# EAGLE design Lora TDS sensor V1.2 (EAGLE 6.1)
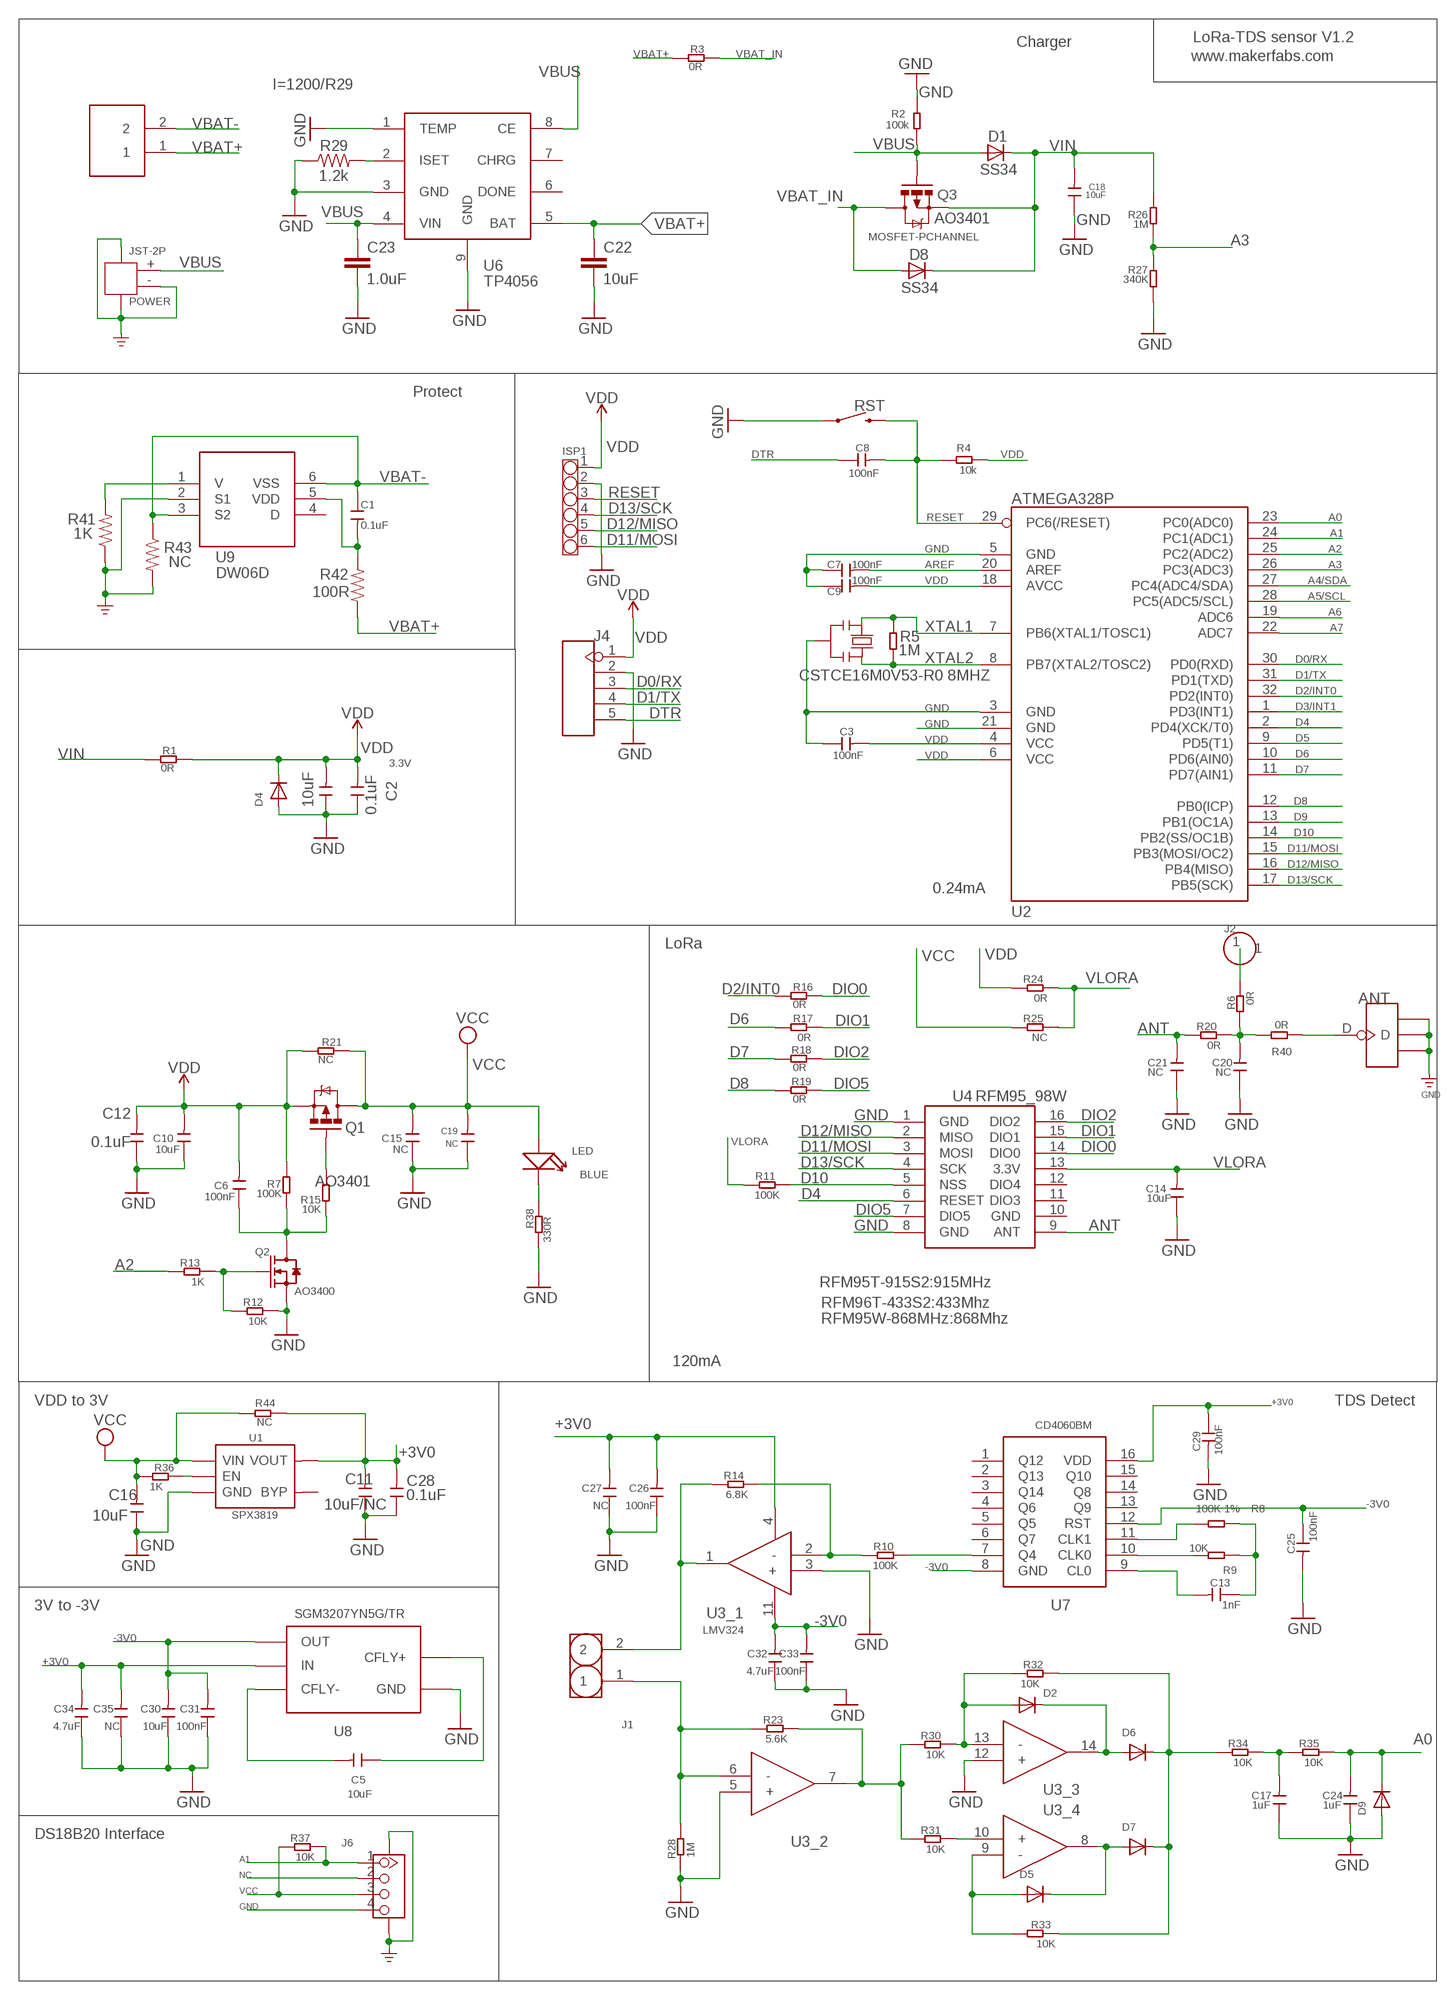
[diagram p0: schematic, sheet 1]

## Parts
ANT  ANTENNA-U-FL  [4P-U-FL]
C1  0.1uF  C-0603  [0603]
C2  0.1uF  C-0603  [0603]
C3  100nF  C-0603  [0603]
C4  10uF  C-0603  [0603]
C5  10uF  C-0603  [0603]
C6  100nF  C-0603  [0603]
C7  100nF  C-0603  [0603]
C8  100nF  C-0603  [0603]
C9  100nF  C-0603  [0603]
C10  10uF  C-0603  [0603]
C11  10uF/NC  C-0603  [0603]
C12  0.1uF  C-0603  [0603]
C13  1nF  C-0603  [0603]
C14  10uF  C-0603  [0603]
C15  NC  C-0603  [0603]
C16  10uF  C-0603  [0603]
C17  1uF  C-0603  [0603]
C18  10uF  C-0603  [0603]
C19  NC  C-0603  [0603]
C20  NC  C-0603  [0603]
C21  NC  C-0603  [0603]
C22  10uF  10UF-1206-6.3V-20%  [1206]
C23  1.0uF  1.0UF-0603-16V-10%  [0603]
C24  1uF  C-0603  [0603]
C25  100nF  C-0603  [0603]
C26  100nF  C-0603  [0603]
C27  NC  C-0603  [0603]
C28  0.1uF  C-0603  [0603]
C29  100nF  C-0603  [0603]
C30  10uF  C-0603  [0603]
C31  100nF  C-0603  [0603]
C32  4.7uF  C-0603  [0603]
C33  100nF  C-0603  [0603]
C34  4.7uF  C-0603  [0603]
C35  NC  C-0603  [0603]
D1  SS34  DIODE-DO-214AC  [DO-214AC]
D2  DIODESOD-323F  [SOD-323F]
D4  DIODESOD-323F  [SOD-323F]
D5  DIODESOD-323F  [SOD-323F]
D6  DIODESOD-323F  [SOD-323F]
D7  DIODESOD-323F  [SOD-323F]
D8  SS34  DIODE-DO-214AC  [DO-214AC]
D9  DIODESOD-323F  [SOD-323F]
ISP1  CONNECTOR-HEADER-6P-3460270P1  [1X6P-2.54-8.5-BLACK-FEMALE]
J1  HEADER-2P-65/35MIL  [2P-2.54-65/35MIL]
J2  HEADER-1P-50  [1P-100/50MIL]
J4  HEADER-5P-2.54  [5P-2.54]
J5  PH2.0-2P-90-DIP  [PH2.0-2P-90-DIP]
J6  GROVE-CONNECTOR-SMD'90D'  [HW4-SMD-2.0-90D]
LED  BLUE  LED'0603'  [LED-0603]
POWER  JST-2P  JST-2P-SMD'2.0'  [HW2-SMD-2.0-90D]
Q1  MOSFET-PCHANNEL  [SOT23-3]
Q2  AO3400  DISCRETE_MOSFET-NSOT23  [DISCRETE_SOT23]
Q3  MOSFET-PCHANNEL  [SOT23-3]
R1  0R  R-0603  [R0603]
R2  100k  R-0603  [R0603]
R3  0R  R-0603  [R0603]
R4  10k  R-0603  [R0603]
R5  1M  R-0603  [R0603]
R6  0R  R-0603  [R0603]
R7  100K  R-0603  [R0603]
R8  100K 1%  R-0603  [R0603]
R9  10K  R-0603  [R0603]
R10  100K  R-0603  [R0603]
R11  100K  R-0603  [R0603]
R12  10K  R-0603  [R0603]
R13  1K  R-0603  [R0603]
R14  6.8K  R-0603  [R0603]
R15  10K  R-0603  [R0603]
R16  0R  R-0603  [R0603]
R17  0R  R-0603  [R0603]
R18  0R  R-0603  [R0603]
R19  0R  R-0603  [R0603]
R20  0R  R-0603  [R0603]
R21  NC  R-0603  [R0603]
R23  5.6K  R-0603  [R0603]
R24  0R  R-0603  [R0603]
R25  NC  R-0603  [R0603]
R26  1M  R-0603  [R0603]
R27  340K  R-0603  [R0603]
R28  1M  R-0603  [R0603]
R29  1.2k  2.49KOHM-0603-1/10W-1%  [0603]
R30  10K  R-0603  [R0603]
R31  10K  R-0603  [R0603]
R32  10K  R-0603  [R0603]
R33  10K  R-0603  [R0603]
R34  10K  R-0603  [R0603]
R35  10K  R-0603  [R0603]
R36  1K  R-0603  [R0603]
R37  10K  R-0603  [R0603]
R38  330R  R-0603  [R0603]
R40  0R  R-0603  [R0603]
R41  1K  10KOHM-0603-1/10W-1%  [0603]
R42  100R  10KOHM-0603-1/10W-1%  [0603]
R43  NC  10KOHM-0603-1/10W-1%  [0603]
R44  NC  R-0603  [R0603]
RST  MOMENTARY-SWITCH-SPST-SMD-6.0X3.5MM  [TACTILE_SWITCH_SMD_6.0X3.5MM]
U1  SPX3819  [SOT23-5]
U2  ATMEGA328P  ATMEGA8/168/328  [TQFP32]
U3  LM324_1  [SOP-14]
U4  RFM95_98W  RFM92_93W  [RFM92_93W]
U6  TP4056  [SOP8-1.27P]
U7  CD4060  [SOIC-16]
U8  TPS60400DBVR  [SOT23-5]
U9  DW06D  [SOT-23-6]
Y1  CSTCE16M0V53-R0 8MHZ  RESONATORMU  [RESONATOR]

## Nets
+3V0: C11.2 C26.2 C27.2 C28.2 C29.1 C34.2 C35.2 R44.2 U1.5(VOUT) U3.4(_1:VDD) U7.16(VDD) U8.P$2(IN)
-3V0: C25.1 C30.2 C31.2 C32.2 C33.2 U3.11(_1:VSS) U7.8(GND) U7.12(RST) U8.P$1(OUT)
A0: C24.2 D9.C R35.1 U2.23(PC0(ADC0))
A1: J6.1 R37.1 U2.24(PC1(ADC1))
A2: R13.2 U2.25(PC2(ADC2))
A3: R26.1 R27.2 U2.26(PC3(ADC3))
A4/SDA: U2.27(PC4(ADC4/SDA))
A5/SCL: U2.28(PC5(ADC5/SCL))
A6: U2.19(ADC6)
A7: U2.22(ADC7)
ANT: C21.2 R20.2 U4.9(ANT)
AREF: C7.2 U2.20(AREF)
D0/RX: J4.3 U2.30(PD0(RXD))
D1/TX: J4.4 U2.31(PD1(TXD))
D2/INT0: R16.1 U2.32(PD2(INT0))
D3/INT1: U2.1(PD3(INT1))
D4: U2.2(PD4(XCK/T0)) U4.6(RESET)
D5: U2.9(PD5(T1))
D6: R17.1 U2.10(PD6(AIN0))
D7: R18.1 U2.11(PD7(AIN1))
D8: R19.1 U2.12(PB0(ICP))
D9: U2.13(PB1(OC1A))
D10: R11.1 U2.14(PB2(SS/OC1B)) U4.5(NSS)
D11/MOSI: ISP1.6 U2.15(PB3(MOSI/OC2)) U4.3(MOSI)
D12/MISO: ISP1.5 U2.16(PB4(MISO)) U4.2(MISO)
D13/SCK: ISP1.4 U2.17(PB5(SCK)) U4.4(SCK)
DIO0: R16.2 U4.14(DIO0)
DIO1: R17.2 U4.15(DIO1)
DIO2: R18.2 U4.16(DIO2)
DIO5: R19.2 U4.7(DIO5)
DTR: C8.1 J4.5
GND: ANT.GND1 ANT.GND2 ANT.GND3 C2.1 C3.1 C4.1 C7.1 C9.1 C10.1 C11.1 C12.1 C14.1 C15.1 C16.1 C17.1 C18.1 C19.1 C20.1 C21.1 C22.2 C23.2 C24.1 C25.2 C26.1 C27.1 C28.1 C29.2 C30.1 C31.1 C32.1 C33.1 C34.1 C35.1 D4.A D9.A ISP1.2 J4.2 J6.4 J6.SS1 J6.SS2 POWER.3 POWER.4 POWER.- Q2.2(S) R2.2 R12.1 R27.1 R28.2 R29.1 R38.2 R41.1 R43.2 RST.1 U1.2(GND) U2.3(GND) U2.5(GND) U2.21(GND) U3.3(_1:+) U3.5(_2:+) U3.12(_4:+) U4.1(GND) U4.8(GND) U6.1(TEMP) U6.3(GND) U6.9(GND) U8.P$4(GND) U9.2(S1) Y1.2
ISET: R29.2 U6.2(ISET)
N$1: C1.2 R42.2 U9.5(VDD)
N$2: R36.2 U1.3(EN)
N$3: LED.- R38.1
N$4: R8.1 U7.11(CLK1)
N$5: R9.1 U7.10(CLK0)
N$6: J2.1 R6.1
N$7: Q1.1(G) R15.2
N$8: C6.1 Q2.3(D) R7.1 R15.1
N$9: C13.2 U7.9(CL0)
N$10: Q2.1(G) R12.2 R13.1
N$11: C13.1 R8.2 R9.2
N$12: C20.2 R6.2 R20.1 R40.1
N$13: R41.2 U9.1(V)
N$15: C5.2 U8.P$3(CFLY-)
N$16: R10.1 U7.7(Q4)
N$17: C5.1 U8.P$5(CFLY+)
N$18: R10.2 R14.1 U3.2(_1:-)
N$19: J1.2 R14.2 U3.1(_1:OUT)
N$20: J1.1 R23.2 R28.1 U3.6(_2:-)
N$21: R23.1 R30.2 R31.2 U3.7(_2:OUT)
N$22: D2.A R30.1 R32.2 U3.13(_4:-)
N$23: D2.C D6.A U3.14(_4:OUT)
N$24: R31.1 U3.10(_3:+)
N$25: D6.C D7.C R32.1 R33.1 R34.2
N$26: D5.A R33.2 U3.9(_3:-)
N$27: D5.C D7.A U3.8(_3:OUT)
N$28: ANT.D R40.2
N$29: C17.2 R34.1 R35.2
NC: J6.2
RESET: C8.2 ISP1.3 R4.2 RST.2 U2.29(PC6(/RESET))
VBAT+: C22.1 J5.1 R3.2 R42.1 U6.5(BAT)
VBAT-: C1.1 J5.2 R43.1 U9.3(S2) U9.6(VSS)
VBAT_IN: D8.A Q3.3(D) R3.1
VBUS: C23.1 D1.A POWER.+ Q3.1(G) R2.1 U6.4(VIN) U6.8(CE)
VCC: C15.2 C16.2 C19.2 J6.3 LED.+ Q1.3(D) R21.1 R25.2 R36.1 R37.2 R44.1 U1.1(VIN)
VDD: C2.2 C3.2 C4.2 C6.2 C9.2 C10.2 C12.2 D4.C ISP1.1 J4.1 Q1.2(S) R1.1 R4.1 R7.2 R21.2 R24.2 U2.4(VCC) U2.6(VCC) U2.18(AVCC)
VIN: C18.2 D1.C D8.C Q3.2(S) R1.2 R26.2
VLORA: C14.2 R11.2 R24.1 R25.1 U4.13(3.3V)
XTAL1: R5.2 U2.7(PB6(XTAL1/TOSC1)) Y1.1
XTAL2: R5.1 U2.8(PB7(XTAL2/TOSC2)) Y1.3
Unconnected: U1.4(BYP) U4.11(DIO3) U4.12(DIO4) U6.6(DONE) U6.7(CHRG) U7.1(Q12) U7.2(Q13) U7.3(Q14) U7.4(Q6) U7.5(Q5) U7.6(Q7) U7.13(Q9) U7.14(Q8) U7.15(Q10) U9.4(D)

## Notes on the sheet
- LoRa-TDS sensor V1.2
- Charger
- www.makerfabs.com
- I=1200/R29
- AO3401
- Protect
- 3.3V
- 0.24mA
- LoRa
- AO3401
- RFM95T-915S2:915MHz
- RFM96T-433S2:433Mhz
- RFM95W-868MHz:868Mhz
- 120mA
- VDD to 3V | TDS Detect
- 3V to -3V
- SGM3207YN5G/TR
- DS18B20 Interface

## Power pins joined to a net without a drawn wire
GND: U4.10(GND)

## Library data of the parts
ANT = Connector:ANTENNA-U-FL
C1-C21 C24-C35 = Discrete:C*: Ceramic Capacitors
C22 = SparkFun-Capacitors:10UF: 10.0µF ceramic capacitors A capacitor is a passive two-terminal electrical component used to store electrical energy temporarily in an electric field.; PROD_ID: CAP-10057
C23 = SparkFun-Capacitors:1.0UF: 1µF ceramic capacitors A capacitor is a passive two-terminal electrical component used to store electrical energy temporarily in an electric field.; PROD_ID: CAP-00868
D1 D8 = diode:DIODE-: DIODE
D2 D4-D7 D9 = adafruit2:DIODE: Diode SMADIODE - SMA Surface Mount Package 20V 1A Schottky Diode Digikey: 641-1014-6-ND DO-1N4148 - Through Hole Small Current Diode SOD-123 20V 1 A (.5mV Vf) Schottky Diode - Digikey: MBRX120TPMSCT-ND SOD-323 10V 570mA (.38mV Vf, 3ns) Schottky Diode - Digikey: ZLLS410CT-ND SOD-523 30V 30mA Schottky Diode (RB751S-40TE61) - Digikey: RB751S-40TE61CT-ND SOT23-R/W - SOT23 Package (R = Solder Paste/Reflow Ovens, W = Hand-Soldering) BAT54Film 40V 300mA - Digikey: 497-7162-1-ND
ISP1 = OPL Eagle Library:CONNECTOR-HEADER-6P
J1 = Connector:HEADER-2P
J2 = Connector:HEADER-1P
J4 = Connector:HEADER-5P
J5 = Connector:PH2.0-2P-90-DIP
J6 = Connector-new:GROVE-CONNECTOR-SMD: 4P-SMD-2.0:320110030;4P-SMD-2.0-90D:320110032
LED = Discrete:LED*
POWER = Connector-new:JST-2P-SMD: 2P-SMD-1.0-90D:320110054;2P-SMD-2.0-90D:320110026
Q1 Q3 = User-Submitted:MOSFET-PCHANNEL: Generic PMOSFET IRLML2244 - TRANS-11153 (SOT-23 -20V -4.3A) (1.Gate 2.Source 3.Drain) FQP27P06 - COM-10349 <http://www.sparkfun.com/products/10349> (TO-220 -60V -27A) (1.Gate 2.Source 3.Drain); PROD_ID: TRANS-08285
Q2 = A9G:DISCRETE_MOSFET-N: IRLL014: http://www.vishay.com/docs/91319/sihll014.pdf
R1-R21 R23-R28 R30-R38 R40 R44 = Discrete:R*
R29 = SparkFun-Resistors:2.49KOHM: 2.49kΩ resistor A resistor is a passive two-terminal electrical component that implements electrical resistance as a circuit element. Resistors act to reduce current flow, and, at the same time, act to lower voltage levels within circuits. - Wikipedia; PROD_ID: RES-09568; VALUE: 2.49k
R41-R43 = SparkFun-Resistors:10KOHM: 10kΩ resistor A resistor is a passive two-terminal electrical component that implements electrical resistance as a circuit element. Resistors act to reduce current flow, and, at the same time, act to lower voltage levels within circuits.; PROD_ID: RES-00824; VALUE: 10k
RST = SparkFun-Switches:MOMENTARY-SWITCH-SPST: Momentary Switch (Pushbutton) - SPST Normally-open (NO) SPST momentary switches (buttons, pushbuttons). Variants PTH-12MM - 12mm square, through-hole Momentary Pushbutton Switch - 12mm Square <https://www.sparkfun.com/products/9190> (COM-09190) PTH-6.0MM, PTH-6.0MM-KIT - 6.0mm square, through-hole Mini Pushbutton Switch <https://www.sparkfun.com/products/97> (COM-00097) KIT package intended for soldering kit's - only one side of pads' copper is exposed. PTH-RIGHT-ANGLE-KIT - Right-angle, through-hole Right Angle Tactile Button <https://www.sparkfun.com/products/10791> - Used on SparkFun BigTime Watch Kit <https://www.sparkfun.com/products/11734> SMD-12MM - 12mm square, surface-mount Tactile Button - SMD (12mm) <https://www.sparkfun.com/products/12993> (COM-12993) Used on SparkFun PicoBoard <https://www.sparkfun.com/products/11888> SMD-4.5MM - 4.5mm Square Trackball Switch Used on SparkFun Blackberry Trackballer Breakout <https://www.sparkfun.com/products/13169> SMD-4.6MMX2.8MM - 4.60mm x 2.80mm, surface mount Used on SparkFun SAMD21 Mini Breakout <https://www.sparkfun.com/products/13664> SMD-5.2MM, SMD-5.2-REDUNDANT - 5.2mm square, surface-mount Mini Pushbutton Switch - SMD <https://www.sparkfun.com/products/8720> (COM-08720) Used on Arduino Pro Mini <https://www.sparkfun.com/products/11114> REDUNDANT package connects both switch circuits together SMD-6.0X3.5MM - 6.0 x 3.5mm, surface mount Momentary Reset Switch SMD <https://www.sparkfun.com/products/8229> (COM-08229) SMD-6.2MM-TALL - 6.2mm square, surface mount Tactile Button - SMD (6mm) <https://www.sparkfun.com/products/12992> Used on SparkFun Digital Sandbox <https://www.sparkfun.com/products/12651> SMD-RIGHT-ANGLE - Right-angle, surface mount Used on SparkFun Block for Intel® Edison - Arduino <https://www.sparkfun.com/products/13036>; PROD_ID: SWCH-00815; SF_SKU: COM-08229
U1 = IC:SPX3819
U2 = IC:ATMEGA8/168/328: MICROCONTROLLER
U3 = 1mytest:LM324_1
U4 = dragino:RFM92_93W
U6 = self:TP4056
U7 = 1mytest:CD4060
U8 = 1mytest:TPS60400DBVR
U9 = self:DW06D
Y1 = SmartPrj:RESONATOR

## Net classes
0 default: width 0.203 mm, drill 0.305 mm, clearance 0.152 mm

## Board
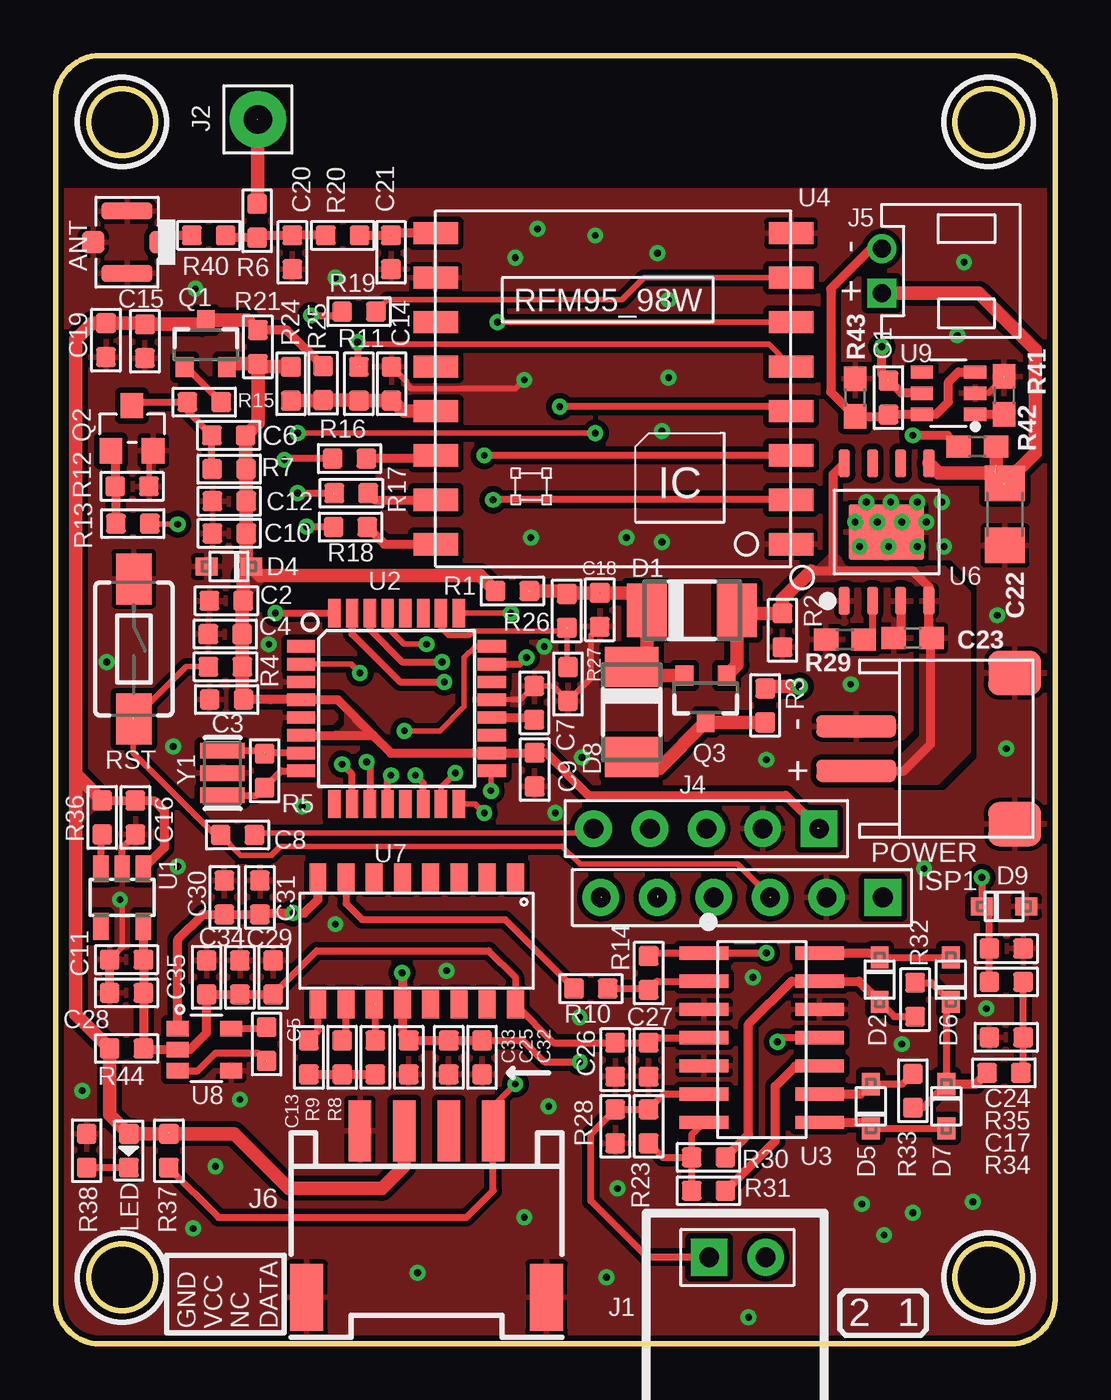
[diagram p1: board, top side]
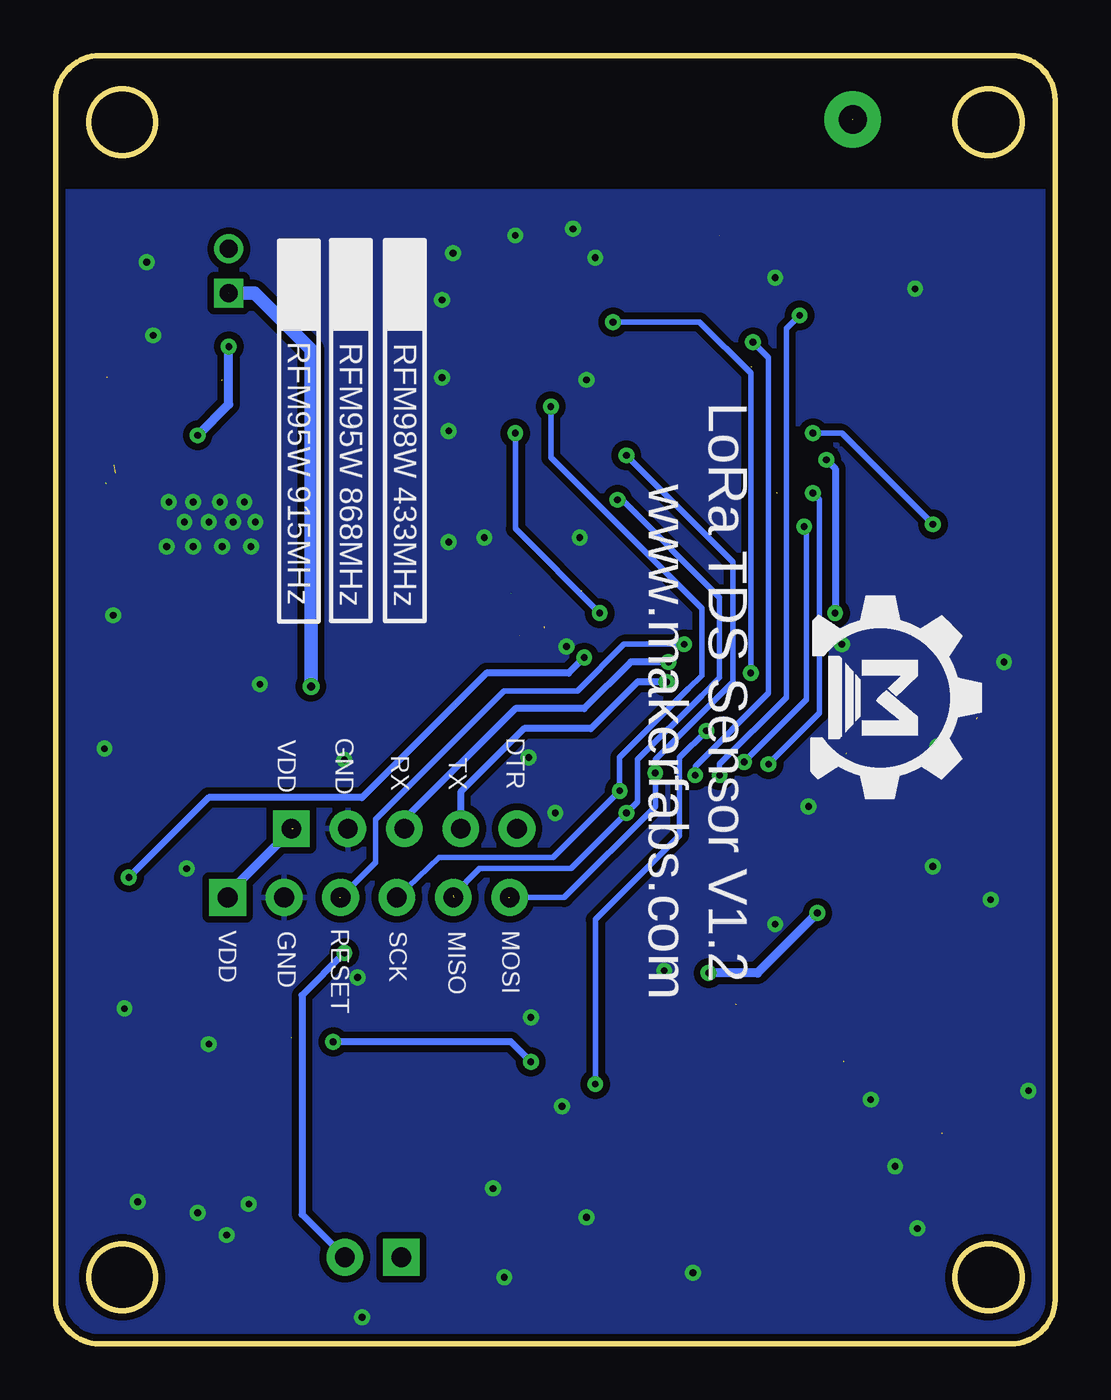
[diagram p2: board, bottom side, seen from below]

Size 45 x 58 mm. Coordinates in mm from the lower left corner, seen from the top.
Outline: 0,2 0,56 arc-90 2,58 43,58 arc-90 45,56 45,2 arc-90 43,0 2,0 arc-90 0,2
Outline: circle at 3,3 radius 1.5
Outline: circle at 42,3 radius 1.5
Outline: circle at 3,55 radius 1.5
Outline: circle at 42,55 radius 1.5
Copper layers (1*16): Top 0.035mm / dielectric 1.5mm / Bottom 0.035mm
Design rules: minimum track width 10mil, minimum drill 12mil, track to track 6mil, track to pad 6mil, pad to pad 6mil, via to via 6mil, smd to smd 0mil, copper to edge 10mil, drill to drill 10mil, minimum pad ring 10mil, minimum via ring 8mil, stop-mask expansion 4mil, vias tented up to drill 100mil, thermal gap 8mil
tRestrict: area 0.1,52.3 to 46,58
bRestrict: area 0.1,52.3 to 45.9,58

### Footprints (pad centres in the part's own frame; a part is rotated, then mirrored left to right if it is on the bottom)
4P-U-FL = smd 1.016 x 1.016: D -1.524,0; GND3 1.524,0 | smd 2.286 x 0.762: GND1 0,1.397; GND2 0,-1.397
0603 = smd 0.889 x 0.889: 1 -0.762,0; 2 0.762,0
1206 = smd 1.6 x 1.8: 1 -1.4,0; 2 1.4,0
0603' = smd 1.1 x 1: 1 -0.85,0; 2 0.85,0
DO-214AC = smd 1.8 x 2.4: A 2.025,0; C -2.025,0
SOD-323F = smd 1 x 0.8: A -1,0; C 1,0
1X6P-2.54-8.5-BLACK-FEMALE = drill 0.889 pad 1.651 square: 1 0,6.35 | drill 0.889 pad 1.651: 2 0,3.81; 3 0,1.27; 4 0,-1.27; 5 0,-3.81; 6 0,-6.35
2P-2.54-65/35MIL = drill 0.889 pad 1.651 square: 1 0,1.27 | drill 0.889 pad 1.651: 2 0,-1.27
1P-100/50MIL = drill 1.27 pad 2.54: 1 0,0
5P-2.54 = drill 0.889 pad 1.651 square: 1 0,5.08 | drill 0.889 pad 1.651: 2 0,2.54; 3 0,0; 4 0,-2.54; 5 0,-5.08
PH2.0-2P-90-DIP = drill 0.8 square: 1 0,1 | drill 0.8: 2 0,-1
HW4-SMD-2.0-90D = smd 1.01 x 2.74: 1 -3,-0.1; 2 -1,-0.1; 3 1,-0.1; 4 3,-0.1 | smd 1.5 x 3: SS1 -5.4,7.4; SS2 5.4,7.4
LED-0603 = smd 0.889 x 0.889: + -0.762,0; - 0.762,0
HW2-SMD-2.0-90D = smd 2 x 2.4: 3 3.4,-2.181; 4 -3.4,-2.181 | smd 1 x 3.6: + -1,4.953; - 1,4.953
SOT23-3 = smd 0.8 x 0.9: 1 -0.95,-1; 2 0.95,-1; 3 0,1.1
DISCRETE_SOT23 = smd 1.016 x 1.143: 1 -0.95,-1.016; 2 0.95,-1.016; 3 0,1.016
R0603 = smd 0.889 x 0.889: 1 -0.762,0; 2 0.762,0
TACTILE_SWITCH_SMD_6.0X3.5MM = smd 2.3 x 1.6: 1 -3.15,0; 2 3.15,0
SOT23-5 = smd 0.69 x 1.2: 1 -0.95,-1.3; 2 0,-1.3; 3 0.95,-1.3; 4 0.95,1.3; 5 -0.95,1.3
TQFP32 = smd 1.27 x 0.559: 1 -4.293,2.8; 2 -4.293,2; 3 -4.293,1.2; 4 -4.293,0.4; 5 -4.293,-0.4; 6 -4.293,-1.2; 7 -4.293,-2; 8 -4.293,-2.8; 17 4.293,-2.8; 18 4.293,-2; 19 4.293,-1.2; 20 4.293,-0.4; 21 4.293,0.4; 22 4.293,1.2; 23 4.293,2; 24 4.293,2.8 | smd 0.559 x 1.27: 9 -2.8,-4.293; 10 -2,-4.293; 11 -1.2,-4.293; 12 -0.4,-4.293; 13 0.4,-4.293; 14 1.2,-4.293; 15 2,-4.293; 16 2.8,-4.293; 25 2.8,4.293; 26 2,4.293; 27 1.2,4.293; 28 0.4,4.293; 29 -0.4,4.293; 30 -1.2,4.293; 31 -2,4.293; 32 -2.8,4.293
SOP-14 = smd 0.6 x 2.2: 1 0,0; 2 1.27,0; 3 2.54,0; 4 3.81,0; 5 5.08,0; 6 6.35,0; 7 7.62,0; 8 7.62,5.2; 9 6.35,5.2; 10 5.08,5.2; 11 3.81,5.2; 12 2.54,5.2; 13 1.27,5.2; 14 0,5.2
RFM92_93W = smd 2 x 1: 1 -8,7; 2 -8,5; 3 -8,3; 4 -8,1; 5 -8,-1; 6 -8,-3; 7 -8,-5; 8 -8,-7; 9 8,-7; 10 8,-5; 11 8,-3; 12 8,-1; 13 8,1; 14 8,3; 15 8,5; 16 8,7
SOP8-1.27P = smd 1.27 x 0.51: 1 -3.1,1.905; 2 -3.1,0.635; 3 -3.1,-0.635; 4 -3.1,-1.905; 5 3.1,-1.905; 6 3.1,-0.635; 7 3.1,0.635; 8 3.1,1.905 | smd 2.5 x 3.4: 9 0,0
SOIC-16 = smd 0.76 x 1.27: 1 0,0; 2 1.27,0; 3 2.54,0; 4 3.81,0; 5 5.08,0; 6 6.35,0; 7 7.62,0; 8 8.89,0; 9 8.89,5.72; 10 7.62,5.72; 11 6.35,5.72; 12 5.08,5.72; 13 3.81,5.72; 14 2.54,5.72; 15 1.27,5.72; 16 0,5.72
SOT23-5' = smd 0.7 x 1: P$1 0,0; P$2 0.95,0; P$3 1.9,0; P$4 1.9,2.4; P$5 0,2.4
SOT-23-6 = smd 1 x 0.6: 1 -1.2,0.95; 2 -1.2,0; 3 -1.2,-0.95; 4 1.2,-0.95; 5 1.2,0; 6 1.2,0.95
RESONATOR = smd 0.7 x 2: 1 -1,0; 2 0,0; 3 1,0

### Placement (x,y rotation side)
ANT  3.22,49.6 180 top
C1  37.5,42.6 90 top
C2  7.69,33.45 0 top
C3  7.7,29.01 0 top
C4  7.64,31.95 0 top
C5  9.5,13.5 270 top
C6  7.8,40.9 0 top
C7  21.56,28.86 270 top
C8  8.2,22.91 180 top
C9  21.57,25.85 90 top
C10  7.83,36.49 0 top
C11  3.2,17.3 0 top
C12  7.83,37.94 0 top
C13  11.4,12.9 90 top
C14  15.13,43.23 270 top
C15  4.02,45.14 90 top
C16  3.6,23.7 90 top
C17  42.8,13.8 0 top
C18  24.5,33.05 90 top
C19  2.27,45.19 90 top
C20  10.66,49.14 90 top
C21  15.1,49.14 90 top
C22  42.74,37.35 270 top
C23  1.0uF  [0603']  38.59,31.78 180 top
C24  42.8,17.8 180 top
C25  15.9,12.9 270 top
C26  25.2,12.8 90 top
C27  26.7,12.8 90 top
C28  3.2,15.8 0 top
C29  9.8,16.5 90 top
C30  7.6,20.1 270 top
C31  9.2,20.1 270 top
C32  19.2,12.9 90 top
C33  17.7,12.9 90 top
C34  8.3,16.5 270 top
C35  6.8,16.5 270 top
D1  28.66,33.03 0 top
D2  37.1,16.4 90 top
D4  7.8,35 0 top
D5  36.7,10.7 270 top
D6  40.3,16.4 270 top
D7  40.1,10.7 90 top
D8  25.94,28.44 270 top
D9  42.7,19.7 180 top
ISP1  30.9,20.1 270 top
J1  30.7,3.9 90 top
J2  9.11,55.12 0 top
J4  29.3,23.2 270 top
J5  37.2,48.3 180 top
J6  16.7,9.5 180 top
LED  3.3,8.7 270 top
POWER  41,26.8 90 top
Q1  6.77,44.98 0 top
Q2  3.44,41.22 0 top
Q3  29.27,29.09 180 top
R1  20.57,33.89 0 top
R2  32.73,32.13 270 top
R3  31.95,28.74 90 top
R4  7.65,30.49 180 top
R5  9.41,25.81 90 top
R6  9.08,50.56 270 top
R7  7.82,39.39 0 top
R8  14.4,12.9 270 top
R9  12.9,12.9 270 top
R10  24.1,16 0 top
R11  13.65,43.22 270 top
R12  3.44,38.61 180 top
R13  3.48,36.93 0 top
R14  26.7,16.7 90 top
R15  6.7,42.4 0 top
R16  13.23,39.85 0 top
R17  13.32,38.3 0 top
R18  13.28,36.77 0 top
R19  13.66,46.47 0 top
R20  12.93,49.9 0 top
R21  9.11,44.88 270 top
R23  26.7,9.8 90 top
R24  10.6,43.22 90 top
R25  12.04,43.25 90 top
R26  23.02,33 90 top
R27  23.07,29.71 90 top
R28  25.2,9.8 270 top
R29  1.2k  [0603']  35.54,31.71 0 top
R30  29.4,8.4 180 top
R31  29.4,6.9 180 top
R32  38.7,15.5 270 top
R33  38.6,11.4 90 top
R34  42.7,12.2 180 top
R35  42.8,16.3 0 top
R36  2.1,23.7 270 top
R37  5.1,8.7 90 top
R38  1.4,8.7 90 top
R40  6.9,49.9 180 top
R41  1K  [0603']  42.7,42.7 270 top
R42  100R  [0603']  41.5,40.4 180 top
R43  NC  [0603']  36,42.6 90 top
R44  3.2,13.3 0 top
RST  3.53,31.29 270 top
U1  3,20.1 180 top
U2  15.35,28.6 0 top
U3  29.2,17.6 270 top
U4  25.11,43 180 top
U6  37.41,36.55 90 top
U7  20.7,21 180 top
U8  TPS60400DBVR  [SOT23-5']  5.5,14.2 270 top
U9  40.2,42.8 180 top
U$2  [MAKERFABS_0.3]  10.94,33.21 270 bottom
Y1  7.51,25.7 270 top

### Tracks (layer width: path | path; a pad name or v marks a point on that pad's centre or on a via)
+3V0
  Top 0.305: C29.1 11.76,17.7 19.5,17.7 20.7,16.5 U7.16 22.42,13.56 C26.2 | C26.2 | C26.2 C27.2 26.93,13.79 U3.4
  Top 0.406: U1.5 3.95,17.31 C11.2 C28.2 R44.2 4.01,13.25 U8.P$2 6.05,13.25 6.8,14 C35.2 | C35.2 | C35.2 C34.2 | C34.2 | C34.2 C29.1 | C29.1
-3V0  (via drill 0.3)  (1 unrouted)
  Top 0.305: C32.2 21.04,13.66 22,12.7 v23.6,12.7 | v32.5,13.6 32.7,13.8 U3.11
  Top 0.406: U8.P$1 | U8.P$1 5.5,18.2 6.64,19.34 C30.2 | C30.2 | C30.2 C31.2 9.26,19.4 v10.7,19.4 11.2,19.4 11.81,20.01 U7.8 | v15.6,16.7 15.62,16.68 U7.12 15.62,13.94 C25.1 C33.2 | C33.2 | C33.2 C32.2
  Bottom 0.305: v23.6,12.7 24.5,13.6 v32.5,13.6
  Bottom 0.406: v10.7,19.4 13.4,16.7 v15.6,16.7
A0  (via drill 0.3)  (1 unrouted)
  Top 0.305: R35.1 C24.2 42.04,19.36 D9.C v41.7,21 | U2.23 20.9,30.6 v21.2,30.9
  Bottom 0.305: v41.7,21 38.1,24.6 31.2,24.6 27,28.8 25.6,30.2 21.9,30.2 v21.2,30.9
A1  (via drill 0.3)
  Top 0.254: U2.24 18.9,31.4 18.4,30.9 18.4,28.7 17.3,27.6 v15.7,27.6 | v20.7,11.7 19.7,10.7 J6.1
  Top 0.305: R37.1 7.34,5.7 18.5,5.7 19.7,6.9 J6.1
  Bottom 0.254: v20.7,11.7 20.7,19.1 16.9,22.9 16.9,26.4 v15.7,27.6
A2  (via drill 0.3)
  Top 0.254: U2.25 v20.5,32.9 | R13.2 4.28,36.9 v5.5,36.9 | v10.9,41 v24.3,41
  Bottom 0.254: v5.5,36.9 9.6,41 v10.9,41 | v24.3,41 24.3,36.7 v20.5,32.9
A3  (1 unrouted)
  Top 0.254: U2.26 17.35,32.25 17.7,31.9 18.6,31.9 18.8,32.1 22.8,32.1 arc90 23,32.3 | R27.2 23.02,30.52 R26.1
ANT  (1 unrouted)
  Top 0.406: U4.9 15.2,50 C21.2 | C21.2 R20.2
AREF
  Top 0.406: U2.20 21.46,28.2 C7.2
D0/RX  (via drill 0.3)
  Top 0.305: U2.30 14.15,32.15 15.6,30.7 v17.4,30.7
  Bottom 0.305: v17.4,30.7 19.1,30.7 21.2,28.6 24.3,28.6 29.3,23.6 J4.3
D1/TX  (via drill 0.3)
  Top 0.305: U2.31 13.35,31.95 15.5,29.8 v17.5,29.8
  Bottom 0.305: v17.5,29.8 18.8,29.8 20.9,27.7 23.9,27.7 26.76,24.84 J4.4
D2/INT0  (via drill 0.3)
  Top 0.305: R16.1 10.35,39.85 v10.3,39.8 | U2.32 v9.91,32.89 v9.9,32.9
  Bottom 0.305: v10.3,39.8 9.9,39.4 v9.9,32.9
D4  (via drill 0.3)  (1 unrouted)
  Top 0.254: U2.2 13.3,30.6 v13.7,30.2 | v19.9,46 U4.6
  Bottom 0.254: v13.7,30.2 13.7,43.7 16,46 v19.9,46
D6  (via drill 0.3)  (1 unrouted)
  Top 0.305: U2.10 13.35,25.65 v12.9,26.1 | v10.9,38.3 12.5,38.3
  Bottom 0.254: v12.9,26.1 10.6,28.4 10.6,38 v10.9,38.3
D7  (via drill 0.3)
  Top 0.305: R18.1 11.33,36.77 v11.3,36.8 | v14,26.2 14.15,26.05 U2.11
  Bottom 0.254: v14,26.2 11.2,29 11.2,36.7 v11.3,36.8
D8  (via drill 0.3)
  Top 0.305: U2.12 14.95,25.45 v15.1,25.6 | v11.5,46.3 12.73,46.3 R19.1
  Bottom 0.254: v15.1,25.6 15.1,26.1 12.1,29.1 12.1,45.7 v11.5,46.3
D10  (via drill 0.3)  (1 unrouted)
  Top 0.254: U4.5 32.11,45 13.7,45 v13.6,45.1
  Top 0.305: U2.14 16.55,25.25 v16.2,25.6 | v13.6,45.1 13.6,44.1 13.7,44
  Bottom 0.254: v13.6,45.1 12.9,44.4 12.9,29.3 16.2,26 v16.2,25.6
D11/MOSI  (via drill 0.3)  (1 unrouted)
  Top 0.254: U2.15 17.35,25.05 v18,25.7
  Top 0.305: U4.3 | U4.3 v19.3,40
  Bottom 0.254: 24.6,20.1 22.1,20.1 18,24.2 v18,25.7 18,26.3 14.5,29.8 14.5,35.2 v19.3,40
D12/MISO  (via drill 0.3)  (1 unrouted)
  Top 0.254: U2.16 18.89,24.31 v19.3,23.9
  Top 0.305: U4.2 | U4.2 v19.7,38
  Bottom 0.254: 27.1,20.2 25.9,21.4 21.8,21.4 v19.3,23.9 18.8,24.4 18.8,26.3 15.9,29.2 15.1,30 15.1,33.6 19.5,38 v19.7,38
D13/SCK  (via drill 0.3)
  Top 0.254: U2.17 19.6,25.76 v19.6,24.9
  Top 0.305: U4.4 32.91,42.2 v22.7,42.2
  Bottom 0.254: ISP1.4 27.73,21.9 22.6,21.9 v19.6,24.9 19.6,26.4 16.5,29.5 15.9,30.1 15.9,33.1 22.7,39.9 v22.7,42.2
DIO0
  Top 0.406: U4.14 16.97,39.85 R16.2
DIO1
  Top 0.406: R17.2 14.38,38 U4.15
DIO2
  Top 0.406: R18.2 14.81,36 U4.16
DIO5
  Top 0.254: R19.2 14.95,47 25.5,47 26.5,48 U4.7
DTR
  Top 0.254: J4.5 24.02,23 9.05,23 arc90 C8.1
GND  (via drill 0.3)  (2 unrouted)
  Top 0.254: U9.2 42,42.8 42.7,43.5 | U2.21 20.94,29 C7.1 22.39,29.62 R27.1 24.1,29.98 24.1,31.9 | C18.1 24.1,31.89 | Q2.2 4.21,40.02 R12.1 | C14.1 15.8,43.32 15.8,43.2 16,43 20.7,43 v21.1,43.4 | C11.1 3,17.86 3,19.9
  Top 0.305: U1.2 3,22.34 C16.1
  Top 0.406: U6.3 38.05,32.09 C23.2 | C28.1 C11.1
  other vias: 22,31.4 35.8,29.7 5.5,21.5 2.3,30.7 21.1,5.7 25.3,7 23.6,14.7 31.4,16.5 25.7,36.3 27.6,43.5 12.6,48 6.3,47.5 20.7,48.9 27.1,49.1 24.3,49.9 40.9,48.7 40.6,45.4 12.6,18.9 41.9,15.1 39.1,21.4 32,26.3 22.2,10.7 8.3,11 36.5,37.9 37.6,37.9 38.8,37.9 42.4,32.8 36,37 36.2,35.9 37,37 38.1,37 39.2,37 37.5,35.9 38.8,35.9 39.9,37.9 40,35.9 36.3,6.3 38.6,5.9 41.3,6.4 37.3,4.9 31.2,1.2 24.8,3 16.3,3.2 6.2,5.2 2.9,20 38.1,13.5 5.3,26.9 11.1,24.2 1.2,11.4 7.2,8 22.5,23.9 27.3,41.1 27.6,47 21.4,36.3 23.7,26.4 17.6,16.8 42.8,26.8 27.3,36.1 9.6,31.5 21.7,50.2
  pour Top (isolate 0.254, rank 4): -4,47.4 -4,60.67 -3.37,61.3 22.8,61.3 47.17,61.3 47.8,60.67 47.8,37.6 47.8,-2.16 47.17,-2.8 19.2,-2.8 -3.37,-2.8 -4,-2.16
  pour Bottom (isolate 0.305, rank 5): -2,41.2 -2,60.77 -1.36,61.4 27,61.4 46.87,61.4 47.5,60.77 47.5,34.7 47.5,-1.16 46.87,-1.8 19.1,-1.8 -1.36,-1.8 -2,-1.16
ISET
  Top 0.305: U6.2 36.78,32.1 R29.2
N$1  (via drill 0.3)  (1 unrouted)
  Top 0.406: R42.2 40.15,40.9 v38.6,40.9 | U9.5 38.1,42.8 37.5,43.4 | C1.2 37.2,43.66 v37.2,44.9
  Bottom 0.406: v38.6,40.9 37.2,42.3 v37.2,44.9
N$2
  Top 0.305: U1.3 2.05,22.89 R36.2
N$3
  Top 0.305: LED.- R38.1
N$4  (1 unrouted)
  Top 0.305: R8.1 | R8.1 14.4,15.3
N$5
  Top 0.305: R9.1 13.08,13.84 U7.10
N$6  (1 unrouted)
  Top 0.406: R6.1 9.11,51.35
  Top 0.61: 9.11,51.35 9.11,55.09 9.1,55.1
N$7
  Top 0.305: R15.2 5.88,43.98 Q1.1
N$8
  Top 0.305: R7.1 7.04,39.4 C6.1 5.94,42 R15.1 3.61,42.4 Q2.3
N$9
  Top 0.305: C13.2 11.81,14.07 U7.9
N$10
  Top 0.406: Q2.1 2.68,40.02 R12.2 2.72,38.57 R13.1
N$11
  Top 0.406: C13.1 R9.2 R8.2
N$12
  Top 0.406: R20.1 C20.2 9.18,49.9 R6.2 7.77,49.8 R40.1
N$13
  Top 0.406: U9.1 R41.2
N$15  (1 unrouted)
  Top 0.305: U8.P$3 6.4,12.3 7.2,13.1 9.1,13.1 9.5,12.7
N$16
  Top 0.305: U7.7 13.08,19.82 13.8,19.1 20.24,19.1 R10.1
N$17
  Top 0.305: U8.P$5 9.44,14.2 C5.1
N$18
  Top 0.305: R10.2 26.64,16 R14.1 27.09,16.33 U3.2
N$19  (via drill 0.3)
  Top 0.305: R14.2 26.84,17.6 U3.1 | U3.1 | U3.1 v32,17.6
  Bottom 0.305: v32,17.6 33.9,15.7 33.9,5.83 J1.2
N$20
  Top 0.305: J1.1 26.64,3.9 24.1,6.44 24.1,9.46 R28.1 R23.2 27.39,11.25 U3.6
N$21
  Top 0.305: U3.7 28.64,9.42 R30.2 | R23.1 27.34,8.4 R30.2 | R30.2 R31.2
N$22
  Top 0.305: D2.A 37.76,14.74 R32.2
  Top 0.406: R30.1 31.2,9.44 31.2,14.4 33.13,16.33 U3.13 36.17,16.33 D2.A
N$23
  Top 0.305: D2.C D6.A
  Top 0.406: U3.14 36.9,17.6 D2.C
N$24
  Top 0.406: R31.1 32.4,9.14 32.4,11.6 33.3,12.5 34.38,12.5 U3.10
N$25
  Top 0.305: R33.1 39.04,10.64 D7.C 40.1,15.2 D6.C 39.44,16.26 R32.1
  Top 0.406: D7.C 41.44,11.7 R34.2
N$26
  Top 0.305: 38.46,12.3 R33.2 38.14,11.7 D5.A
  Top 0.406: U3.9 36.25,11.25 D5.A
N$27
  Top 0.305: D5.C D7.A
  Top 0.406: U3.8 36.42,9.98 D5.C
N$28
  Top 0.406: R40.2 5.05,49.9 ANT.D
N$29
  Top 0.305: R34.1 43.56,12.3 C17.2 R35.2
RESET  (via drill 0.3)  (2 unrouted)
  Top 0.254: R4.2 5.88,30.49 RST.2 | 3.5,28.2 3.5,26.6 7.19,22.91 C8.2 8.35,22 9.7,22 10.1,22.4 22.8,22.4 23.6,21.6 30.7,21.6 32.2,20.1 | U2.29 14.95,32.25 15.7,31.5 v16.7,31.5
  Bottom 0.254: v16.7,31.5 19.4,31.5 21.5,29.4 24.8,29.4 26.3,27.9 30.6,23.6 30.6,21.67 ISP1.3
VBAT+  (via drill 0.36)  (3 unrouted)
  Top 0.406: 42.35,39.56 C22.1 42.68,38.81 | R42.1 42.7,40.4
  Top 0.61: 42.35,39.56 R42.1 | U6.5 39.77,39.2 42.3,39.2 | R3.2 32.05,29.6 v33.5,29.6 | J5.1 41.56,47.3 44.1,44.76 44.1,40.1 42.7,38.7
  Bottom 0.61: v33.5,29.6 33.5,44.76 36.04,47.3 J5.1
VBAT-
  Top 0.406: J5.2 36.7,49.3 34.9,47.5 34.9,42.85 R43.1 37.41,41.75 C1.1 38.59,41.84 U9.6 39.65,41.85 40.2,42.4 40.2,43.3 40.65,43.75 U9.3
VBAT_IN
  Top 0.406: Q3.3
  Top 0.61: R3.1 Q3.3 | D8.A 27.19,25.91 Q3.3
VBUS
  Top 0.406: POWER.+ 38.2,25.8 39.4,27 39.4,31.8 39.32,31.88 U6.4 39.32,34.08 38.6,34.8 35,34.8 | 35,34.8 34,34.8 | 31.05,32.89 D1.A | U6.8 35,39.14 35,34.8
  Top 0.61: 34,34.8 32.73,33.53 R2.1 31.05,32.89 | Q3.1 30.69,30.56 D1.A
  pour Top (isolate 0.305): 37.5,25.3 39.7,25.3 41,26.6 41.1,26.7 41.1,33.8 40,34.9 38.6,34.9 35.7,34.9 35.1,35.5 34.9,35.5 34.3,34.9 34,34.9 33.8,34.7 33.8,34.6 34,34.4 35.2,34.4 38.6,34.4 39,34 39,27.6 39,27.3 38.3,26.6 37.9,26.2 37.5,26.2
VCC  (1 unrouted)
  Top 0.406: R25.2 10.41,45.65 R21.1 8.68,46.08 | Q1.3 6.59,45.9 | C15.2 3.97,45.95 | R36.1 C16.2 4.44,24.46 4.9,24 4.9,22.35 U1.1
  Top 0.61: 8.68,46.08 Q1.3 | 6.59,45.9 C15.2 | 3.97,45.95 C19.2 1.65,45.95 0.9,45.2 0.9,25.66 | R36.1 0.9,25.66 | 0.9,25.66 0.9,14.84 R44.1 2.44,10.32 LED.+ 5.16,9.46 5.2,9.5 5.1,9.5 | J6.3 15.7,8 14.7,7 10.5,7 8.04,9.46 R37.2
  pour Top (isolate 0.305, no thermals): 1,25.3 1.3,25.3 2.1,24.5 1.2,23.6 1,23.6
VDD  (1 unrouted)
  Top 0.406: Q1.2 7.86,44.12 | R21.2 9.25,43.99 | C3.2 9.68,29 U2.4 12.7,29 14.3,27.4 | U2.6 | U2.6 14.3,27.4 | 14.3,27.4 15.1,26.6 U2.18 21.59,26.6 C9.2 22.08,26.62 24,24.7 32.88,24.7 J4.1
  Top 0.61: 7.86,44.12 R21.2 9.11,41.45 C6.2 8.56,39.4 R7.2 C12.2 C10.2 8.59,35.21 D4.C | 9.25,43.99 R24.2 | R1.1 19.1,34.6 9.2,34.6 D4.C | 8.61,29.07 C3.2 8.41,29.07 R4.1 C4.2 8.4,33.4 C2.2 8.45,34.65 D4.C
  Bottom 0.406: ISP1.1 37.25,20.25 34.3,23.2
  pour Top (isolate 0.305, no thermals): 8.6,33.9 8.8,33.9 9.5,34.6 8.8,35.3 8.6,35.3
  pour Top (isolate 0.254, no thermals): 12.6,27.5 12.8,27.5 13,27.7 13.1,27.8 13.1,27.9 13.1,28.5 13.2,28.5 14.1,27.6 14.1,27.3 12.6,27.3
VIN  (2 unrouted)
  Top 0.61: Q3.2 26.07,30.09 D8.C 26.64,30.66 D1.C 25.85,33.81 C18.2 | 21.3,33.9 22.68,33.9 R26.2 23.06,33.8 C18.2
VLORA
  Top 0.406: R25.1 12.02,42.46
  Top 0.61: 12.02,42.46 R24.1 | R25.1 13.62,42.49 R11.2 15.23,42.46 C14.2 15.69,42 U4.13
XTAL1  (1 unrouted)
  Top 0.305: U2.7 | U2.7 9.4,26.6 9.3,26.7 Y1.1
XTAL2
  Top 0.305: Y1.3 9.06,24.7 R5.1 10.17,25.8 U2.8

### Text on the board
tPlace: U4 | - | + | - | + | GND | VCC | NC | DATA | 2 | 1
bPlace: RFM98W 433MHz | RFM95W 868MHz | RFM95W 915MHz | LoRa TDS Sensor V1.2 | www.makerfabs.com | DTR | RX | GND | VDD | TX | MOSI | MISO | SCK | RESET | GND | VDD